# Altium schematic sheet Controller.SchDoc: Controller
size A4; CheckedBy: Nico Bieberich; Author: Nico Bieberich; Organization: Baltic Racing; Address1: Zur Schwedenschanze 15; Address2: Haus 18; Address3: 18435 Stralsund; Revision: xx.xx; SheetNumber: 3; SheetTotal: 6; Rules: LVS; SPICEModelCacheCDSOYDZY: <root> / <DocumentId>CDSOYDZY</DocumentId> / <CacheFrame Number="0"> / <Model Name="0603_782631131_120ohm" Kind="CKT"> / <Text>******* / .subckt 0603_782631131_120ohm 1 2 / Rp 1 2 172 / Cp 1 2 0.545p / Rs 1 N3 0.12 / L1 N3 2 0.37u / .ends 0603_782631131_120ohm</Text> / </Model> / </CacheFrame> / </root>
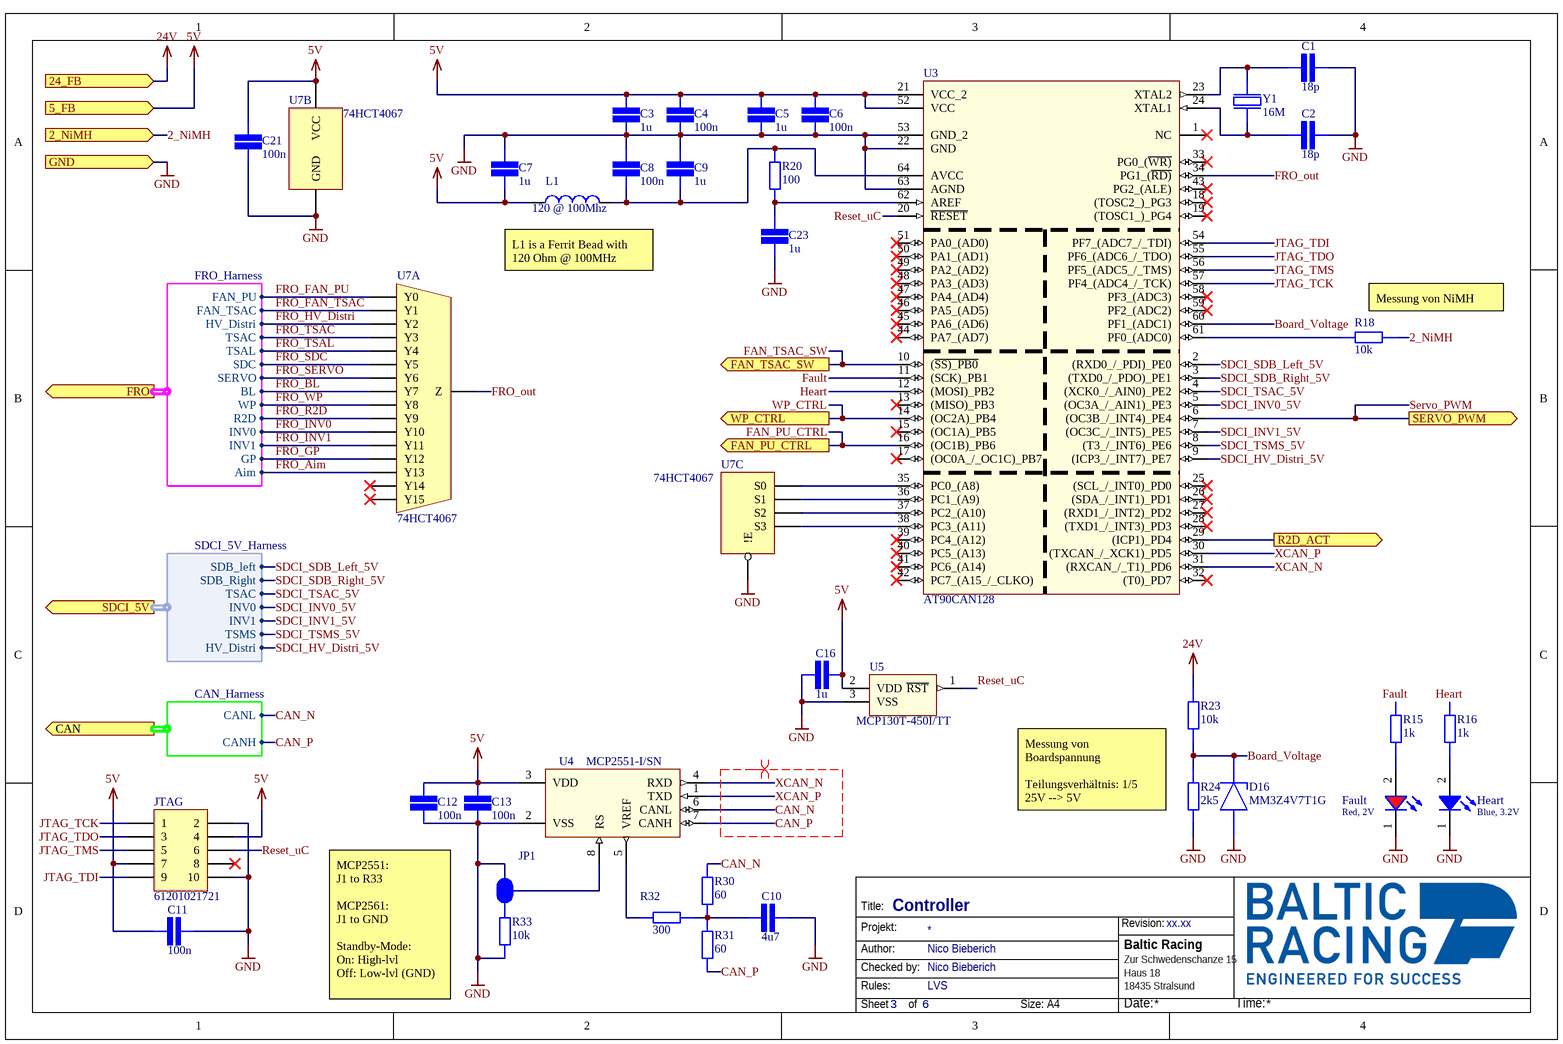
[diagram p0: Controller.SchDoc]

## Parts
C1  value 18p  [CAP 0603/1608]  (hidden comment: SMD Capacitor)
C2  value 18p  [CAP 0603/1608]  (hidden comment: SMD Capacitor)
C3  value 1u  [CAP 0603/1608]  (hidden comment: SMD Capacitor)
C4  value 100n  [CAP 0603/1608]  (hidden comment: SMD Capacitor)
C5  value 1u  [CAP 0603/1608]  (hidden comment: SMD Capacitor)
C6  value 100n  [CAP 0603/1608]  (hidden comment: SMD Capacitor)
C7  value 1u  [CAP 0603/1608]  (hidden comment: SMD Capacitor)
C8  value 100n  [CAP 0603/1608]  (hidden comment: SMD Capacitor)
C9  value 1u  [CAP 0603/1608]  (hidden comment: SMD Capacitor)
C10  value 4u7  [CAP 0603/1608]  (hidden comment: SMD Capacitor)
C11  value 100n  [CAP 0603/1608]  (hidden comment: SMD Capacitor)
C12  value 100n  [CAP 0603/1608]  (hidden comment: SMD Capacitor)
C13  value 100n  [CAP 0603/1608]  (hidden comment: SMD Capacitor)
C16  value 1u  [CAP 0603/1608]  (hidden comment: SMD Capacitor)
C21  value 100n  [CAP 0603/1608]  (hidden comment: SMD Capacitor)
C23  value 1u  [CAP 0603/1608]  (hidden comment: SMD Capacitor)
D16  MM3Z4V7T1G  [SOD-323-2]
Fault  Red, 2V  [WL-SMCW_0603_H=0.7mm]
Heart  Blue, 3.2V  [WL-SMCW_0603_H=0.7mm]
JP1  JUMPERID  [SMD-JUMPER-3]  (value not drawn)  (net tie, no BOM)
JTAG  61201021721  [61201021721]
L1  120 @ 100Mhz  [WE-CBA_0603_L1.6W0.8H0.8_HF/HS/WB]
R15  value 1k  [STACKPOLE CSR0603]  (hidden comment: SMD Resistor)
R16  value 1k  [STACKPOLE CSR0603]  (hidden comment: SMD Resistor)
R18  value 10k  [STACKPOLE CSR0603]  (hidden comment: SMD Resistor)
R20  value 100  [STACKPOLE CSR0603]  (hidden comment: SMD Resistor)
R23  value 10k  [STACKPOLE CSR0603]  (hidden comment: SMD Resistor)
R24  value 2k5  [STACKPOLE CSR0603]  (hidden comment: SMD Resistor)
R30  value 60  [STACKPOLE CSR0603]  (hidden comment: SMD Resistor)
R31  value 60  [STACKPOLE CSR0603]  (hidden comment: SMD Resistor)
R32  value 300  [STACKPOLE CSR0603]  (hidden comment: SMD Resistor)
R33  value 10k  [STACKPOLE CSR0603]  (hidden comment: SMD Resistor)
U3  AT90CAN128  [*QFP80P1600X1600X120-64N]
U4  MCP2551-I/SN  [*SOIC127P600X175-8N]
U5  MCP130T-450I/TT  [*SOT95P237X112-3N]
U7  74HCT4067  [74HCT4067PW]  (parts A,B,C of 3)
Y1  16M  [NDK NX5032GA]

## Ports
2_NiMH (in), 5_FB (in), 24_FB (in), CAN (out, harness CAN_Harness), FAN_PU_CTRL (out), FAN_TSAC_SW (out), FRO (out, harness FRO_Harness), GND (in), R2D_ACT (out), SDCI_5V (out, harness SDCI_5V_Harness), SERVO_PWM (out), WP_CTRL (out)

## Harnesses
SDCI_5V_Harness: SDB_left, SDB_Right, TSAC, INV0, INV1, TSMS, HV_Distri
CAN_Harness: CANL, CANH
FRO_Harness: GP, HV_Distri, BL, SDC, FAN_TSAC, FAN_PU, WP, TSAL, TSAC, INV0, INV1, Aim, SERVO, R2D

## Nets
5V: C3.2 C4.2 C5.2 C6.2 C7.1 C11.2 C12.2 C13.2 C16.1 C21.2 JTAG.4 JTAG.7 L1.1 U3.21(VCC_2) U3.52(VCC) U4.3(VDD) U5.2(VDD) U7.24(VCC) ; port 5_FB
24V: R23.2 ; port 24_FB
GND: C1.1 C2.1 C3.1 C4.1 C5.1 C6.1 C7.2 C8.2 C9.2 C10.2 C11.1 C12.1 C13.1 C16.2 C21.1 C23.1 D16.2A(A) Fault.1(K) Heart.1(K) JP1.1 JTAG.2 JTAG.10 R24.1 R33.1 U3.22(GND) U3.53(GND_2) U3.63(AGND) U4.2(VSS) U5.3(VSS) U7.12(GND) U7.15(!E) ; port GND
2_NiMH: R18.2 ; port 2_NiMH
Board_Voltage: D16.1C(C) R23.1 R24.2 U3.60(PF1_(ADC1))
CAN_N: R30.1 U4.6(CANL) ; port CAN.CANL
CAN_P: R31.2 U4.7(CANH) ; port CAN.CANH
FAN_PU_CTRL: U3.16((OC1B)_PB6) ; port FAN_PU_CTRL
FAN_TSAC_SW: U3.10((~{SS)_PB0}) ; port FAN_TSAC_SW
Fault: R15.1 U3.11((SCK)_PB1)
FRO_Aim: U7.18(Y13) ; port FRO.Aim
FRO_BL: U7.2(Y7) ; port FRO.BL
FRO_FAN_PU: U7.9(Y0) ; port FRO.FAN_PU
FRO_FAN_TSAC: U7.8(Y1) ; port FRO.FAN_TSAC
FRO_GP: U7.19(Y12) ; port FRO.GP
FRO_HV_Distri: U7.7(Y2) ; port FRO.HV_Distri
FRO_INV0: U7.21(Y10) ; port FRO.INV0
FRO_INV1: U7.20(Y11) ; port FRO.INV1
FRO_out: U3.34(PG1_(~{RD)}) U7.1(Z)
FRO_R2D: U7.22(Y9) ; port FRO.R2D
FRO_SDC: U7.4(Y5) ; port FRO.SDC
FRO_SERVO: U7.3(Y6) ; port FRO.SERVO
FRO_TSAC: U7.6(Y3) ; port FRO.TSAC
FRO_TSAL: U7.5(Y4) ; port FRO.TSAL
FRO_WP: U7.23(Y8) ; port FRO.WP
Heart: R16.1 U3.12((MOSI)_PB2)
JTAG_TCK: JTAG.1 U3.57(PF4_(ADC4_/_TCK))
JTAG_TDI: JTAG.9 U3.54(PF7_(ADC7_/_TDI))
JTAG_TDO: JTAG.3 U3.55(PF6_(ADC6_/_TDO))
JTAG_TMS: JTAG.5 U3.56(PF5_(ADC5_/_TMS))
R2D_ACT: U3.29((ICP1)_PD4) ; port R2D_ACT
Reset_uC: JTAG.6 U3.20(~{RESET}) U5.1(~{RST})
SDCI_HV_Distri_5V: U3.9((ICP3_/_INT7)_PE7) ; port SDCI_5V.HV_Distri
SDCI_INV0_5V: U3.5((OC3A_/_AIN1)_PE3) ; port SDCI_5V.INV0
SDCI_INV1_5V: U3.7((OC3C_/_INT5)_PE5) ; port SDCI_5V.INV1
SDCI_SDB_Left_5V: U3.2((RXD0_/_PDI)_PE0) ; port SDCI_5V.SDB_left
SDCI_SDB_Right_5V: U3.3((TXD0_/_PDO)_PE1) ; port SDCI_5V.SDB_Right
SDCI_TSAC_5V: U3.4((XCK0_/_AIN0)_PE2) ; port SDCI_5V.TSAC
SDCI_TSMS_5V: U3.8((T3_/_INT6)_PE6) ; port SDCI_5V.TSMS
Servo_PWM: U3.6((OC3B_/_INT4)_PE4) ; port SERVO_PWM
WP_CTRL: U3.14((OC2A)_PB4) ; port WP_CTRL
XCAN_N: U3.31((RXCAN_/_T1)_PD6) U4.4(RXD)
XCAN_P: U3.30((TXCAN_/_XCK1)_PD5) U4.1(TXD)
NetC1_2: C1.2 U3.23(XTAL2) Y1.2
NetC2_2: C2.2 U3.24(XTAL1) Y1.1
NetC8_1: C8.1 C9.1 L1.2 R20.2 U3.64(AVCC)
NetC10_1: C10.1 R30.2 R31.1 R32.2
NetC23_2: C23.2 R20.1 U3.62(AREF)
NetFault_2: Fault.2(A) R15.2
NetHeart_2: Heart.2(A) R16.2
NetJP1_2: JP1.2 U4.8(RS)
NetJP1_3: JP1.3 R33.2
NetR18_1: R18.1 U3.61(PF0_(ADC0))
NetR32_1: R32.1 U4.5(VREF)
NetU3_35: U3.35(PC0_(A8)) U7.10(S0)
NetU3_36: U3.36(PC1_(A9)) U7.11(S1)
NetU3_37: U3.37(PC2_(A10)) U7.14(S2)
NetU3_38: U3.38(PC3_(A11)) U7.13(S3)

Not connected (* = marked no-connect by the designer): JTAG 8*; U3 1(NC)* 13((MISO)_PB3)* 15((OC1A)_PB5)* 17((OC0A_/_OC1C)_PB7)* 18((TOSC2_)_PG3)* 19((TOSC1_)_PG4)* 25((SCL_/_INT0)_PD0)* 26((SDA_/_INT1)_PD1)* 27((RXD1_/_INT2)_PD2)* 28((TXD1_/_INT3)_PD3)* 32((T0)_PD7)* 33(PG0_(~{WR)})* 39(PC4_(A12))* 40(PC5_(A13))* 41(PC6_(A14))* 42(PC7_(A15_/_CLKO))* 43(PG2_(ALE))* 44(PA7_(AD7))* 45(PA6_(AD6))* 46(PA5_(AD5))* 47(PA4_(AD4))* 48(PA3_(AD3))* 49(PA2_(AD2))* 50(PA1_(AD1))* 51(PA0_(AD0))* 58(PF3_(ADC3))* 59(PF2_(ADC2))*; U7 16(Y15)* 17(Y14)*

## Layout directives
differential pair; differential pair class CAN_LINES; net class CAN: CAN_N, CAN_P, XCAN_N, XCAN_P

## Notes on the sheet
- (near L1) L1 is a Ferrit Bead with
  120 Ohm @ 100MHz
- (near R18) Messung von NiMH
- Messung von Boardspannung
  Teilungsverhältnis: 1/5
  25V --> 5V
- MCP2551:
  J1 to R33
  MCP2561:
  J1 to GND
  Standby-Mode:
  On: High-lvl
  Off: Low-lvl (GND)
- Title:
- Projekt:
- Revision:
- Author:
- Rules:
- Checked by:
- Sheet
- of
- Size:
- A4
- Date:
- Time:

## Library data of the parts
C1-C13 C16 C21 C23 = SMD Capacitor: Capacitor with multiple Footprints; Voltage: 16
D16 = MM3Z4V7T1G: onsemi MM3Z4V7T1G / Z-Diode, 4,7V; ComponentLink1Description: Octopart; ComponentLink1URL: https://octopart.com/mm3z4v7t1g-onsemi-331144?r=sp
Fault = 150060RS75000: WL-SMCW SMT Mono-color Chip LED Waterclear, size 0603, Red, 2V, 140deg; Chip Technology: AlInGaP; Dominant Wavelength typ.: 625nm; Luminous Intensity typ.: 250mcd; Peak Wavelength typ.: 630nm; Viewing Angle: 140deg; ComponentLink1Description: Manufacturer; ComponentLink1URL: http://www.we-online.de; ComponentLink2URL: https://www.we-online.com/catalog/datasheet/150060RS75000.pdf; ComponentLink2Description: Datasheet; Forward Voltage typ.: 2V; Emitting Color: Red; Mounting Technology: SMT; Operating Temperature: -40 to +85degC; Published Date: December 2019; Part Number: 150060RS75000; Packaging: Tape and Reel; Size: 0603; Publisher: Wurth Elektronik
Heart = 150060BS75000: WL-SMCW SMT Mono-color Chip LED Waterclear, size 0603, Blue, 3.2V, 140deg; Chip Technology: InGaN; Dominant Wavelength typ.: 470nm; Luminous Intensity typ.: 145mcd; Peak Wavelength typ.: 465nm; Viewing Angle: 140deg; ComponentLink1Description: Manufacturer; ComponentLink1URL: http://www.we-online.de; ComponentLink2URL: https://www.we-online.com/catalog/datasheet/150060BS75000.pdf; ComponentLink2Description: Datasheet; Forward Voltage typ.: 3.2V; Emitting Color: Blue; Mounting Technology: SMT; Operating Temperature: -40 to +85degC; Published Date: December 2019; Part Number: 150060BS75000; Packaging: Tape and Reel; Size: 0603; Publisher: Wurth Elektronik
JP1 = SMD Jumper 3
JTAG = 61201021721: WR-BHD 2.54mm Male Angled Box Header; Manufacturer: Wurth Elektronik; ComponentLink1 Description: Manufacturer; ComponentLink2 Description: Datasheet; NoPins: 10; Created Date: March 2016; partNo: 61201021721; ComponentLink1URL: http://www.we-online.com; ComponentLink2URL: http://katalog.we-online.de/em/datasheet/6120xx21721.pdf; Created by: Baojun Chen
L1 = 782631131: WE-CBA SMT EMI Suppression Ferrite Bead, size 0603, 120Ohm, 0.5A; Manufacturer: Wurth Elektronik; Case/Size Code: 0603; DC Resistance Max: 0.12Ohm; Impedance Max: 200Ohm; Type: Wide Band; Manufacturer Part Number: 782631131; Category: Ferrites for PCB Assembly; Match Code: WE-CBA; ComponentLink1Description: Website Link; ComponentLink1URL: https://www.we-online.com/redexpert/article/782631131?ad; ComponentLink2Description: Datasheet Link; ComponentLink2URL: https://www.we-online.com/redexpert/spec/782631131?ad; Mount: Surface Mount; Operating Temperature Max: 125°C; Operating Temperature Min: -55°C; Packaging: Tape and Reel; Length: 1.6mm; Width: 0.8mm; Height: 0.8mm; Automotive: Yes; Impedance @100MHz: 120Ohm; Rated Current: 0.5A
R15 R16 R18 R20 R23 R24 R30-R33 = SMD Resistor: Resistor with multiple footprints; Power: 0.1W
U3 = AT90CAN128: Ic Mcu 8bit 128kb Flash 64tqfp; MP: AT90CAN128-16AI; MF: Microchip; Package: TQFP-64 Microchip; SnapEDA_Link: https://www.snapeda.com/parts/AT90CAN128-16AI/Microchip/view-part/?ref=snap; Price: None; Availability: Unavailable; Value: *
U4 = MCP2551-I/SN: MCP2551 Series 5.5 V 1 Mb/s Surface Mount High-Speed CAN Transceiver - SOIC-8; MF: Microchip; MP: MCP2551-I/SN; SnapEDA_Link: https://www.snapeda.com/parts/MCP2551-I/SN/Microchip/view-part/?ref=snap; Price: None; Package: SOIC-8 Microchip; Availability: Unavailable; Value: *
U5 = MCP130T-450I/TT: System Supervisors - Power Supply Monitors with Reset Generators Open Drain Low; MF: Microchip; MP: MCP120T-450I/TT; Price: None; SnapEDA_Link: https://www.snapeda.com/parts/MCP120T-450I/TT/Microchip/view-part/?ref=snap; Package: SOT-23-3 Microchip; Availability: Unavailable; Value: *
U7 = 74HCT4067: Nexperia 74HCT4067 / 16-channel analog multiplexer
Y1 = 16 MHz Quartz